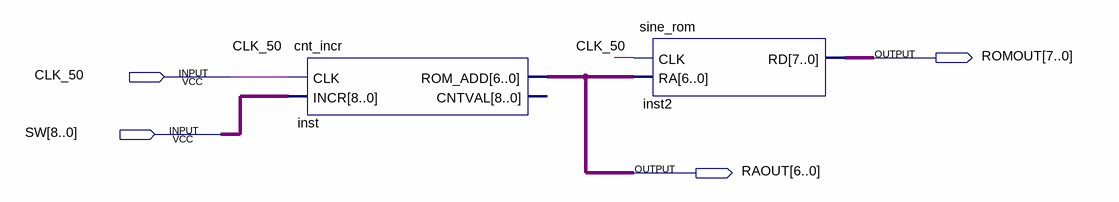
[diagram p0: schematic sheet]
// Quartus schematic start_6.bdf as structural Verilog: 2 symbols, 4 pins
module start_6 (
  input  CLK_50,
  input  [8:0] SW,
  output [7:0] ROMOUT,
  output [6:0] RAOUT
);

  cnt_incr inst (.CLK(CLK_50), .INCR(SW), .ROM_ADD(RAOUT));  // open: CNTVAL
  sine_rom inst2 (.CLK(CLK_50), .RA(RAOUT), .RD(ROMOUT));
endmodule
